# Altium project 功率主板.PrjPcb
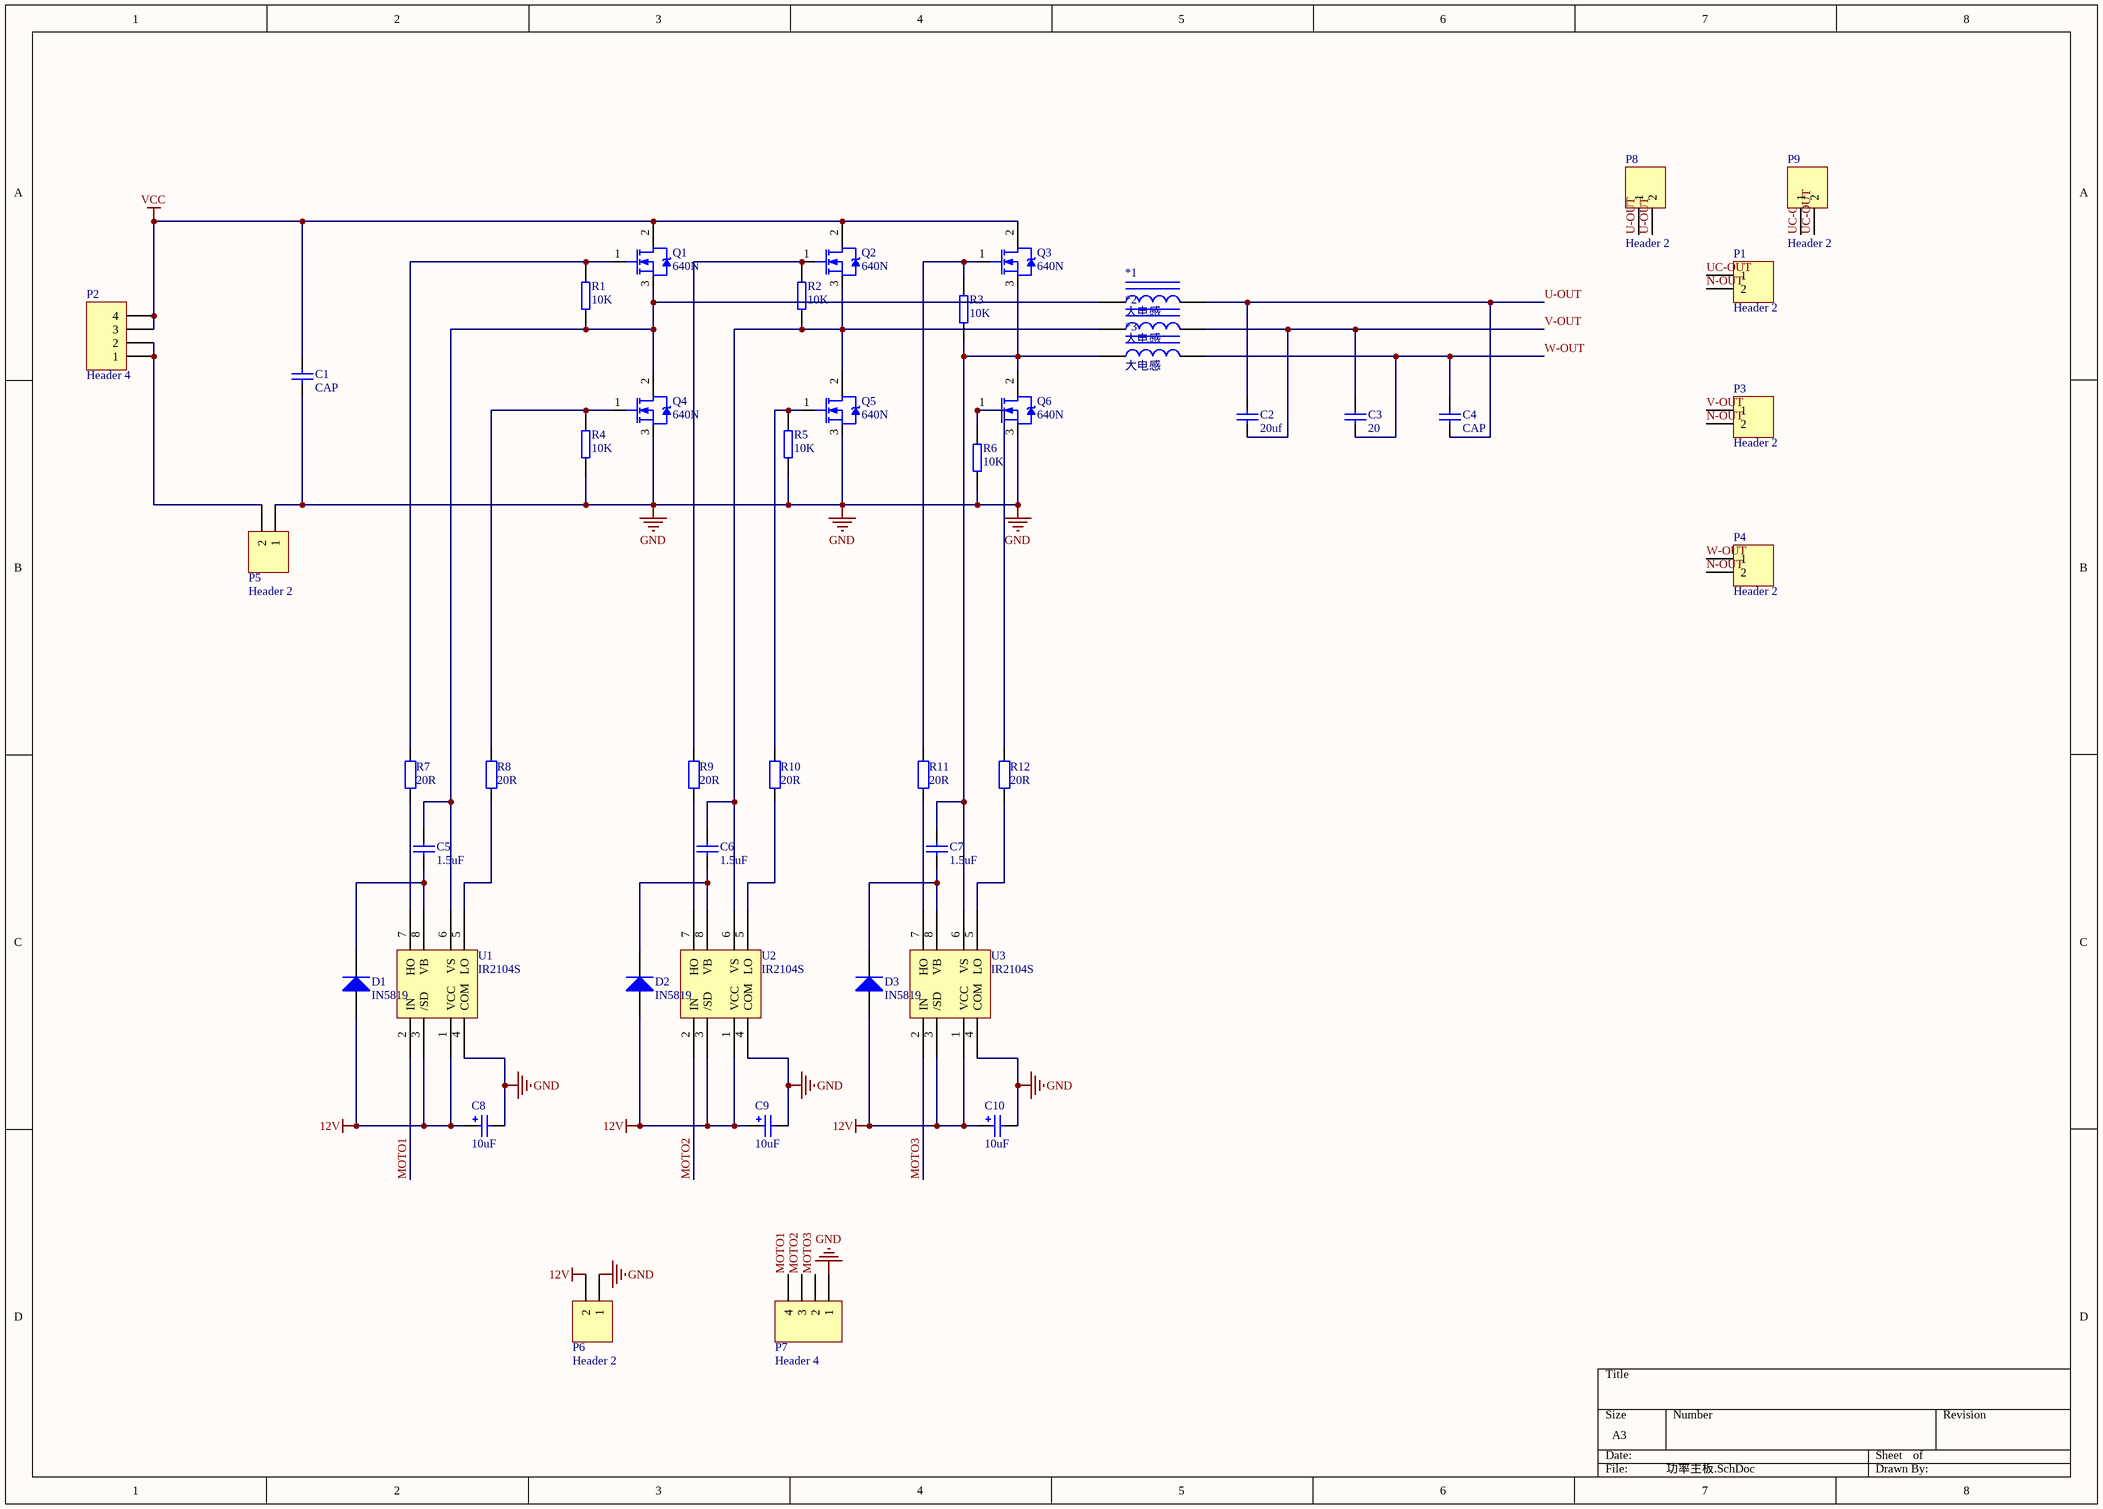
[diagram p0: 功率主板.SchDoc]
1 sheet, 46 parts. Net scope: global (net labels, ports and power ports of the same name join across sheets).
Board file: 功率主板.PcbDoc

## Sheet 功率主板.SchDoc
size A3

### Parts
*1  大电感  [tie-in]
*2  大电感  [tie-in]
*3  大电感  [tie-in]
C1  CAP  [RB7.6-15]
C2  20uf  [20uF400V]
C3  20  [20uF400V]
C4  CAP  [20uF400V]
C5  value 1.5uF  [接口2]  (hidden comment: Cap Semi)
C6  value 1.5uF  [接口2]  (hidden comment: Cap Semi)
C7  value 1.5uF  [接口2]  (hidden comment: Cap Semi)
C8  value 10uF  [接口2]  (hidden comment: Cap Pol1)
C9  value 10uF  [接口2]  (hidden comment: Cap Pol1)
C10  value 10uF  [接口2]  (hidden comment: Cap Pol1)
D1  IN5819  [DIO7.1-3.9x1.9]
D2  IN5819  [DIO7.1-3.9x1.9]
D3  IN5819  [DIO7.1-3.9x1.9]
P1  Header 2  [tie-in]
P2  Header 4  [BIG_HEAD4]
P3  Header 2  [tie-in]
P4  Header 2  [tie-in]
P5  Header 2  [tie-in]
P6  Header 2  [tie-in]
P7  Header 4  [BIG_HEAD4]
P8  Header 2  [tie-in]
P9  Header 2  [tie-in]
Q1  640N  [SFM-T3/A4.7V]
Q2  640N  [SFM-T3/A4.7V]
Q3  640N  [SFM-T3/A4.7V]
Q4  640N  [SFM-T3/A4.7V]
Q5  640N  [SFM-T3/A4.7V]
Q6  640N  [SFM-T3/A4.7V]
R1  10K  [RES]
R2  10K  [RES]
R3  10K  [RES]
R4  10K  [RES]
R5  10K  [RES]
R6  10K  [RES]
R7  value 20R  [RES]  (hidden comment: Res2)
R8  value 20R  [RES]  (hidden comment: Res2)
R9  value 20R  [RES]  (hidden comment: Res2)
R10  value 20R  [RES]  (hidden comment: Res2)
R11  value 20R  [RES]  (hidden comment: Res2)
R12  value 20R  [RES]  (hidden comment: Res2)
U1  IR2104S  [IR2104S]
U2  IR2104S  [IR2104S]
U3  IR2104S  [IR2104S]

### Nets
12V: C8.1 C9.1 C10.1 D1.1(A) D2.1(A) D3.1(A) P6.2 U1.1(VCC) U1.3(/SD) U2.1(VCC) U2.3(/SD) U3.1(VCC) U3.3(/SD)
GND: C1.1 C8.2 C9.2 C10.2 P5.1 P6.1 P7.1 Q4.3(S) Q5.3(S) Q6.3(S) R4.1 R5.1 R6.1 U1.4(COM) U2.4(COM) U3.4(COM)
VCC: C1.2 P2.3 P2.4 Q1.2(D) Q2.2(D) Q3.2(D)
MOTO1: P7.4 U1.2(IN)
MOTO2: P7.3 U2.2(IN)
MOTO3: P7.2 U3.2(IN)
N-OUT: P1.2 P3.2 P4.2
U-OUT: *1.2 C2.2 C4.1 P8.1 P8.2
UC-OUT: P1.1 P9.1 P9.2
V-OUT: *2.2 C2.1 C3.2 P3.1
W-OUT: *3.2 C3.1 C4.2 P4.1
Net*1_1: *1.1 C5.1 Q1.3(S) Q4.2(D) R1.1 U1.6(VS)
Net*2_1: *2.1 C6.1 Q2.3(S) Q5.2(D) R2.1 U2.6(VS)
Net*3_1: *3.1 C7.1 Q3.3(S) Q6.2(D) R3.1 U3.6(VS)
NetC5_2: C5.2 D1.2(K) U1.8(VB)
NetC6_2: C6.2 D2.2(K) U2.8(VB)
NetC7_2: C7.2 D3.2(K) U3.8(VB)
NetP2_1: P2.1 P2.2 P5.2
NetQ1_1: Q1.1(G) R1.2 R7.2
NetQ2_1: Q2.1(G) R2.2 R9.2
NetQ3_1: Q3.1(G) R3.2 R11.2
NetQ4_1: Q4.1(G) R4.2 R8.2
NetQ5_1: Q5.1(G) R5.2 R10.2
NetQ6_1: Q6.1(G) R6.2 R12.2
NetR7_1: R7.1 U1.7(HO)
NetR8_1: R8.1 U1.5(LO)
NetR9_1: R9.1 U2.7(HO)
NetR10_1: R10.1 U2.5(LO)
NetR11_1: R11.1 U3.7(HO)
NetR12_1: R12.1 U3.5(LO)

### Library data of the parts
C2 C3 = CAP
C5-C7 = Cap Semi: Capacitor (Semiconductor SIM Model); Published: 8-Jun-2000; LatestRevisionDate: 29-May-2009; LatestRevisionNote: IPC-7351 Footprint Added.; PackageReference: C1206; Publisher: Altium Limited; PackageDescription: Chip Capacitor
C8-C10 = Cap Pol1: Polarized Capacitor (Radial); Published: 8-Jun-2000; LatestRevisionDate: 17-Jul-2002; LatestRevisionNote: Re-released for DXP Platform.; PackageReference: RB7.6-15; Publisher: Altium Limited; PackageDescription: Polarized Capacitor (Radial); 2 Leads
D1-D3 = Diode: Default Diode; PackageVersion: Sep-1996; PackageDescription: DO-214-AB/SMC; 2 C-Bend Leads; Body 7.9 x 5.9 mm, inc. leads (LxW); Code_JEDEC: DO-214-AB
P1 P3-P6 P8 P9 = Header 2: Header, 2-Pin; LatestRevisionDate: 17-Jul-2002; LatestRevisionNote: Re-released for DXP Platform.; Publisher: Altium Limited
P2 P7 = Header 4: Header, 4-Pin; LatestRevisionDate: 17-Jul-2002; LatestRevisionNote: Re-released for DXP Platform.; Publisher: Altium Limited
Q1-Q6 = NMOS-2: N-Channel Power MOSFET; Note: Pin 2 is electrically connected to pin 4.; Published: 8-Jun-2000; LatestRevisionDate: 17-Jul-2002; LatestRevisionNote: Re-released for DXP Platform.; DatasheetVersion: PD-9.814; PackageVersion: Feb-1997; PackageReference: TO-220AB; Publisher: Altium Limited; PackageDescription: TO, Thru-Hole, Vertical, Heatsink Mounted; 3 In-Line Leads; Pitch 2.54 mm; ComponentLink1Description: Manufacturer Link; ComponentLink1URL: http://www.irf.com/
R1-R6 = res
R7-R12 = Res2: Resistor; Published: 8-Jun-2000; LatestRevisionDate: 17-Jul-2002; LatestRevisionNote: Re-released for DXP Platform.; PackageReference: AXIAL-0.4; Publisher: Altium Limited; PackageDescription: Axial Device, Thru-Hole; 2 Leads; 0.4 in Pin Spacing
U1-U3 = Component_1_1